# Altium schematic sheet 1_电源部分.schdoc.schdoc
size 431 x 309 mm; Symbol: Sheet-Symbol_A3; Device: Sheet-Symbol_A3; Company: 深圳嘉立创科技发展有限公司; Drawed: 嘉立创EDA; Reviewed: 嘉立创EDA; Version: V0.1; Page Size: A2; @Project Name: 毕业设计板子1; @Page Count: 3; @Update Date: 2024-03-13; @Create Date: 2024-02-22; @Schematic Name: Schematic1; Part Number: JLCPCB-001; @Page No: 1; @Page Name: 电源部分
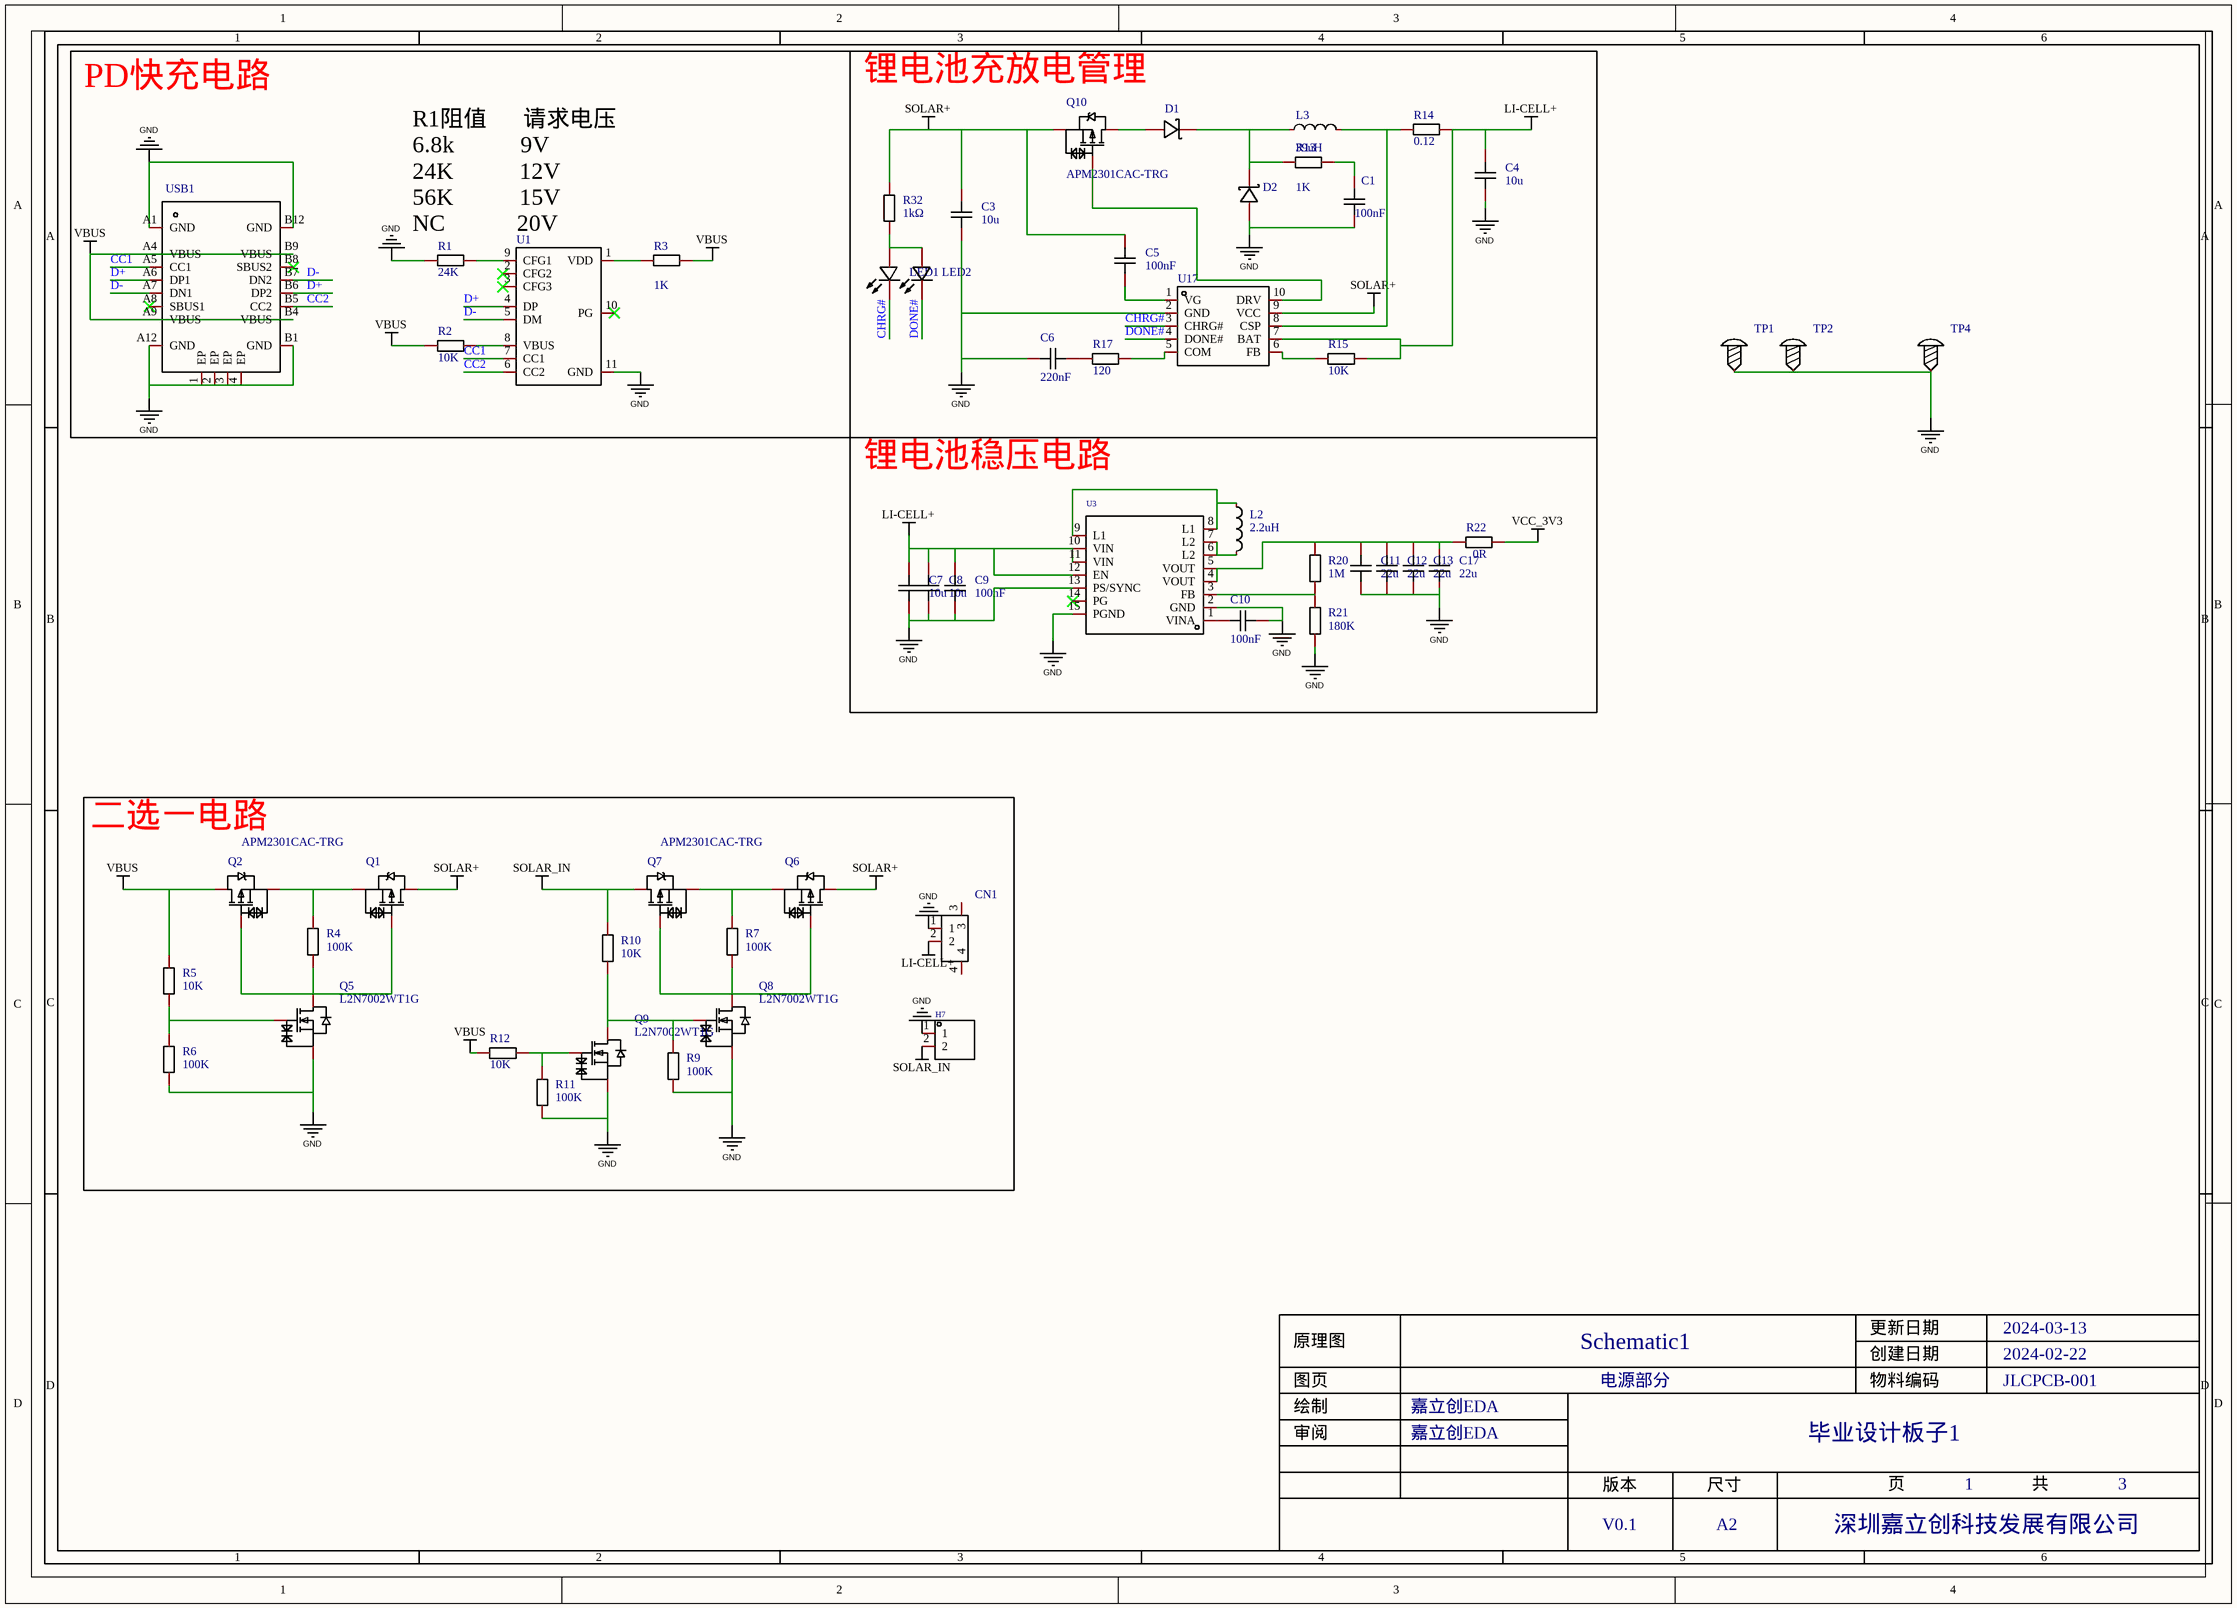
[diagram p0: 1_电源部分.schdoc.schdoc]

## Parts
C1  value 100nF  [C0402]  (hidden comment: CAP_0402)
C3  value 10u  [C0805]  (hidden comment: CAP_0805)
C4  value 10u  [C0805]  (hidden comment: CAP_0805)
C5  value 100nF  [C0402]  (hidden comment: CAP_0402)
C6  value 220nF  [C0402]  (hidden comment: CAP_0402)
C7  value 10u  [C0805]  (hidden comment: CAP_0805)
C8  value 10u  [C0805]  (hidden comment: CAP_0805)
C9  value 100nF  [C0402]  (hidden comment: CAP_0402)
C10  value 100nF  [C0402]  (hidden comment: CAP_0402)
C11  value 22u  [C0805]  (hidden comment: CAP_0805)
C12  value 22u  [C0805]  (hidden comment: CAP_0805)
C13  value 22u  [C0805]  (hidden comment: CAP_0805)
C17  value 22u  [C0805]  (hidden comment: CAP_0805)
CN1  HCZZ0021-2  [CONN-SMD_2P-P2.50-A2501-WF-02A]  (value not drawn)
D1  B340A  [SMA_L4.3-W2.6-LS5.1-RD]  (value not drawn)
D2  B340A  [SMA_L4.3-W2.6-LS5.1-RD]  (value not drawn)
H7  HDR-M_2.54_1x2P  [HDR-TH_2P-P2.54-V-M-1]  (value not drawn)
L2  value 2.2uH  [IND-SMD_L4.4-W4.2]  (hidden comment: MWSA0402S-2R2MT)
L3  value 39uH  [IND-SMD_L10.1-W10.0]  (hidden comment: YDRH104R-390M)
LED1  NCD0805R1  [LED0805-R-RD]  (value not drawn)
LED2  NCD0805R1  [LED0805-R-RD]  (value not drawn)
Q1  APM2301CAC-TRG  [SOT-23-3_L2.9-W1.6-P1.90-LS2.8-BR]  (value not drawn)
Q2  APM2301CAC-TRG  [SOT-23-3_L2.9-W1.6-P1.90-LS2.8-BR]
Q5  L2N7002WT1G  [SC-70-3_L2.1-W1.3-P1.30-LS2.1-BR]
Q6  APM2301CAC-TRG  [SOT-23-3_L2.9-W1.6-P1.90-LS2.8-BR]  (value not drawn)
Q7  APM2301CAC-TRG  [SOT-23-3_L2.9-W1.6-P1.90-LS2.8-BR]
Q8  L2N7002WT1G  [SC-70-3_L2.1-W1.3-P1.30-LS2.1-BR]
Q9  L2N7002WT1G  [SC-70-3_L2.1-W1.3-P1.30-LS2.1-BR]
Q10  APM2301CAC-TRG  [SOT-23-3_L2.9-W1.6-P1.90-LS2.8-BR]
R1  value 24K  [R0402]  (hidden comment: Res_0402)
R2  value 10K  [R0402]  (hidden comment: Res_0402)
R3  value 1K  [R0402]  (hidden comment: Res_0402)
R4  value 100K  [R0402]  (hidden comment: Res_0402)
R5  value 10K  [R0402]  (hidden comment: Res_0402)
R6  value 100K  [R0402]  (hidden comment: Res_0402)
R7  value 100K  [R0402]  (hidden comment: Res_0402)
R9  value 100K  [R0402]  (hidden comment: Res_0402)
R10  value 10K  [R0402]  (hidden comment: Res_0402)
R11  value 100K  [R0402]  (hidden comment: Res_0402)
R12  value 10K  [R0402]  (hidden comment: Res_0402)
R13  value 1K  [R0402]  (hidden comment: Res_0402)
R14  value 0.12  [R1206]  (hidden comment: Res_1206)
R15  value 10K  [R0402]  (hidden comment: Res_0402)
R17  value 120  [R0402]  (hidden comment: Res_0402)
R20  value 1M  [R0402]  (hidden comment: Res_0402)
R21  value 180K  [R0402]  (hidden comment: Res_0402)
R22  value 0R  [R0402]  (hidden comment: Res_0402)
R32  value 1kΩ  [R0805]  (hidden comment: 0805W8F4701T5E)
TP1  M3螺丝  [M3螺丝]  (value not drawn)
TP2  M3螺丝  [M3螺丝]  (value not drawn)
TP4  M3螺丝  [M3螺丝]  (value not drawn)
U1  CH224K  [ESSOP-10_L4.9-W3.9-P1.0-LS6.0-TL-EP]  (value not drawn)
U3  TPS63020DSJT  [VSON-14_L4.0-W3.0-P0.50-BL-EP_TI_DSJ]  (value not drawn)
U17  CN3781  [SSOP-10_L4.9-W3.9-P1.00-LS6.0-BL]  (value not drawn)
USB1  USB_TYPE-C-16P  [USB_TYPE-C-16P]  (value not drawn)

## Blocks framed on the sheet
PD快充电路: R1-R3 U1 USB1
锂电池充放电管理: C1 C3-C6 D1 D2 L3 LED1 LED2 Q10 R13-R15 R17 R32 U17
锂电池稳压电路: C7-C13 C17 L2 R20-R22 U3
二选一电路: CN1 H7 Q1 Q2 Q5-Q9 R4-R7 R9-R12

## Nets
GND: C1.1 C3.1 C4.1 C6.2 C7.1 C8.1 C9.1 C10.1 C11.1 C12.1 C13.1 C17.1 CN1.1 D2.2(A) H7.1 Q5.2(S) Q8.2(S) Q9.2(S) R1.1 R6.1 R9.1 R11.1 R21.1 TP1.1 TP2.1 TP4.1 U1.11(GND) U3.2(GND) U3.13(PS/SYNC) U3.15(PGND) U17.2(GND) USB1.1(EP) USB1.2(EP) USB1.3(EP) USB1.4(EP) USB1.A1(GND) USB1.A12(GND) USB1.B1(GND) USB1.B12(GND)
LI-CELL+: C4.2 C7.2 C8.2 C9.2 CN1.2 R14.2 R15.2 U3.10(VIN) U3.11(VIN) U3.12(EN) U17.7(BAT)
SOLAR+: C3.2 C5.2 Q1.3(D) Q6.3(D) Q10.2(S) R32.2 U17.9(VCC)
SOLAR_IN: H7.2 Q7.3(D) R10.2
VBUS: Q2.3(D) R2.1 R3.2 R5.2 R12.2 USB1.A4(VBUS) USB1.A9(VBUS) USB1.B4(VBUS) USB1.B9(VBUS)
VCC_3V3: R22.2
CC1: U1.7(CC1) USB1.A5(CC1)
CC2: U1.6(CC2) USB1.B5(CC2)
CHRG#: LED1.2(-) U17.3(CHRG#)
D+: U1.4(DP) USB1.A6(DP1) USB1.B6(DP2)
D-: U1.5(DM) USB1.A7(DN1) USB1.B7(DN2)
DONE#: LED2.2(-) U17.4(DONE#)
NetC1_2: C1.2 R13.2
NetC5_1: C5.1 U17.1(VG)
NetC6_1: C6.1 R17.2
NetC10_2: C10.2 U3.1(VINA)
NetC11_2: C11.2 C12.2 C13.2 C17.2 R20.2 R22.1 U3.4(VOUT) U3.5(VOUT)
NetD1_1: D1.1(K) D2.1(K) L3.1 R13.1
NetD1_2: D1.2(A) Q10.3(D)
NetL2_1: L2.1 U3.8(L1) U3.9(L1)
NetL2_2: L2.2 U3.6(L2) U3.7(L2)
NetL3_2: L3.2 R14.1 U17.8(CSP)
NetLED1_1: LED1.1(+) LED2.1(+) R32.1
NetQ1_1: Q1.1(G) Q2.1(G) Q5.3(D) R4.1
NetQ1_2: Q1.2(S) Q2.2(S) R4.2
NetQ5_1: Q5.1(G) R5.1 R6.2
NetQ6_1: Q6.1(G) Q7.1(G) Q8.3(D) R7.1
NetQ6_2: Q6.2(S) Q7.2(S) R7.2
NetQ8_1: Q8.1(G) Q9.3(D) R9.2 R10.1
NetQ9_1: Q9.1(G) R11.2 R12.1
NetQ10_1: Q10.1(G) U17.10(DRV)
NetR1_2: R1.2 U1.9(CFG1)
NetR2_2: R2.2 U1.8(VBUS)
NetR3_1: R3.1 U1.1(VDD)
NetR15_1: R15.1 U17.6(FB)
NetR17_1: R17.1 U17.5(COM)
NetR20_1: R20.1 R21.2 U3.3(FB)

Not connected (* = marked no-connect by the designer): CN1 3 4; U1 2(CFG2)* 3(CFG3)* 10(PG)*; U3 14(PG)*; USB1 A8(SBUS1)* B8(SBUS2)*

## Notes on the sheet
- R1阻值      请求电压
  6.8k           9V
  24K           12V
  56K           15V
  NC            20V
- 1
- 2
- 3
- 4
- 5
- 6
- A
- B
- C
- 原理图
- Schematic1
- 创建日期
- 更新日期
- 2024-03-13
- 2024-02-22
- D
- 审阅
- 绘制
- 图页
- 嘉立创EDA
- 电源部分
- 物料编码
- 毕业设计板子1
- JLCPCB-001
- 版本
- 尺寸
- 页
- 共
- V0.1
- A2
- 深圳嘉立创科技发展有限公司

## Library data of the parts
C1 C5 C6 C9 C10 = CAP_0402: Symbol: CapAcitance; Convert to PCB: yes; Device: CAP_0402; Add into BOM: yes; Supplier Footprint: 0402
C3 C4 C7 C8 C11-C13 C17 = CAP_0805: Symbol: CapAcitance; Convert to PCB: yes; Device: CAP_0805; Add into BOM: yes; Supplier Footprint: 0805
CN1 = HCZZ0021-2: Manufacturer: HC(虹成电子); Add into BOM: yes; Pins Structure: 1x2P; Pitch: 2.54mm; Reference Series: XH; Number of PINs Per Row: 2; Current Rating (Max): 3A; Description: 插针结构:1x2P;间距:2.54mm;安装方式:卧贴;参考系列:XH;总PIN数:2P;排数:1;每排PIN数:2;额定电流:3A;触头材质:黄铜;触头镀层:镀锡;工作温度范围:-25℃~+85℃;; Symbol: HCZZ0021-2; Device: HCZZ0021-2; Supplier: LCSC; Supplier Part: C7433707; Manufacturer Part: HCZZ0021-2; JLCPCB Part Class: 扩展库; LCSC Part Name: 1x2P 间距:2.54mm 卧贴 系列:XH 米色; Supplier Footprint: SMD,P=2.54mm,卧贴; Datasheet: https://atta.szlcsc.com/upload/public/pdf/source/20230707/5E06D7876EC1A6B82AA5D7C4A4436E93.pdf; Convert to PCB: yes; Mounting Style: 卧贴; Number of Pins: 2P; Number of Rows: 1; Contact Material: 黄铜; Contact Plating: 镀锡; Operating Temperature Range: -25℃~+85℃
D1 D2 = B340A: Manufacturer: MDD; Add into BOM: yes; Forward Voltage (Vf@If): 550mV@3A; Reverse Voltage (Vr): 40V; Average Rectified Current (Io): 3A; Description: 正向压降(Vf):550mV@3A;直流反向耐压(Vr):40V;平均整流电流(Io):3A;; Symbol: B340A; Device: B340A; Supplier: LCSC; Manufacturer Part: B340A; Supplier Part: C64982; JLCPCB Part Class: 扩展库; LCSC Part Name: 电压:40V 电流:3A; Supplier Footprint: SMA(DO-214AC); Datasheet: https://atta.szlcsc.com/upload/public/pdf/source/20230710/CC7CF81239BC87A7012E02A96905E83C.pdf; Convert to PCB: yes
H7 = HDR-M_2.54_1x2P: Manufacturer: Ckmtw(灿科盟); Manufacturer Part: B-2100S02P-A110; Symbol: 210S-1*2P L=11.6MMGold-plated black; Convert to PCB: yes; Device: HDR-M_2.54_1x2P; Supplier: LCSC; Supplier Part: C124375; JLCPCB Part Class: Extended Part; Add into BOM: yes; Supplier Footprint: 插件
L2 = MWSA0402S-2R2MT: Manufacturer: Sunlord(顺络); Add into BOM: yes; Tolerance: ±20%; Rated Current: 4.5A; Saturation Current (Isat): 5A; DC Resistance (DCR): 58mΩ; Description: 电感值:2.2uH;精度:±20%;额定电流:4.5A;饱和电流(Isat):5A;类型:-;; Symbol: MWSA0402S-2R2MT; Device: MWSA0402S-2R2MT; LCSC Part Name: 2.2uH ±20% 5A; Supplier Part: C408335; Manufacturer Part: MWSA0402S-2R2MT; Supplier Footprint: SMD; JLCPCB Part Class: 扩展库; Datasheet: https://atta.szlcsc.com/upload/public/pdf/source/20231024/D9DB0CBBB5804BFBC9233D4A02F4216A.pdf; Supplier: LCSC; Convert to PCB: yes; Type: -; Ratings: -
L3 = YDRH104R-390M: Manufacturer: YJYCOIN(益嘉源); Add into BOM: yes; Tolerance: ±20%; Rated Current: 2A; DC Resistance (DCR): 127mΩ; Description: 电感值:39uH;精度:±20%;额定电流:2A;; Symbol: YDRH104R-390M; Device: YDRH104R-390M; Supplier: LCSC; Supplier Part: C339965; Manufacturer Part: YDRH104R-390M; JLCPCB Part Class: 扩展库; LCSC Part Name: 39uH ±20%; Supplier Footprint: SMD,10.1x10.1mm; Datasheet: https://atta.szlcsc.com/upload/public/pdf/source/20200623/C339963_A696F5E6C39A97F8B8D4340808E952C2.pdf; Convert to PCB: yes
LED1 LED2 = NCD0805R1: Manufacturer: 国星光电; Symbol: FC-2012HRK-620D; Add into BOM: yes; Emitted Color: 红色; Forward Voltage (VF): 1.6V~2.6V; Power Dissipation: 65mW; Forward Current: 20mA; Dominant Wavelength: 615nm~630nm; Diode Configuration: 独立二极管; Lens Color: 无色透明透镜; Luminous Intensity: 67mcd~195mcd; Viewing Angle: 130°; Description: 灯头类型:-;发光颜色:红色;正向电压(VF):1.6V~2.6V;功率:65mW;正向电流:20mA;主波长:615nm~630nm;二极管配置:独立二极管;透镜颜色:无色透明透镜;色温:-;发光强度:67mcd~195mcd;发光角度:130°;载带方式:-;工作温度:-30℃~+85℃;; Device: NCD0805R1; Supplier: LCSC; Manufacturer Part: NCD0805R1; Supplier Part: C84256; JLCPCB Part Class: 基础库; LCSC Part Name: NCD0805R1; Supplier Footprint: 0805; Datasheet: https://atta.szlcsc.com/upload/public/pdf/source/20200820/C84256_F0A75A43B3EAD75808600A0514C76B99.pdf; Convert to PCB: yes; Lamp Holder Type: -; Peak Wavelength: -; Color Temperature: -; Mounting Sytle: -; Operating Temperature: -30℃~+85℃
Q1 Q2 Q6 Q7 Q10 = APM2301CAC-TRG: Manufacturer: Sinopower(大中); Add into BOM: yes; Type: P沟道; Drain Source Voltage (Vdss): 20V; Continuous Drain Current (Id): 3A; Power Dissipation (Pd): 830mW; Drain Source On Resistance (RDS(on)@Vgs,Id): 70mΩ@4.5V,3A; Gate Threshold Voltage (Vgs(th)@Id): 1V@250uA; Description: 类型:P沟道;漏源电压(Vdss):20V;连续漏极电流(Id):3A;功率(Pd):830mW;导通电阻(RDS(on)@Vgs,Id):70mΩ@4.5V,3A;阈值电压(Vgs(th)@Id):1V@250uA;; Symbol: APM2301CAC-TRG; Device: APM2301CAC-TRG; LCSC Part Name: P沟道 耐压:20V 电流:3A; Supplier Part: C207575; Manufacturer Part: APM2301CAC-TRG; Supplier Footprint: SOT-23; JLCPCB Part Class: 扩展库; Datasheet: https://atta.szlcsc.com/upload/public/pdf/source/20180412/C207575_1A299DA5768E38A1E092D1ED43A93CE9.pdf; Supplier: LCSC; Convert to PCB: yes
Q5 Q8 Q9 = L2N7002WT1G: Manufacturer: LRC(乐山无线电); Add into BOM: yes; Type: N沟道; Drain Source Voltage (Vdss): 60V; Continuous Drain Current (Id): 115mA; Power Dissipation (Pd): 225mW; Drain Source On Resistance (RDS(on)@Vgs,Id): 7.5Ω@10V,500mA; Gate Threshold Voltage (Vgs(th)@Id): 2.5V@250uA; Description: 类型:N沟道;漏源电压(Vdss):60V;连续漏极电流(Id):115mA;功率(Pd):225mW;导通电阻(RDS(on)@Vgs,Id):7.5Ω@10V,500mA;阈值电压(Vgs(th)@Id):2.5V@250uA;; Symbol: L2N7002WT1G; Device: L2N7002WT1G; Supplier: LCSC; Manufacturer Part: L2N7002WT1G; Supplier Part: C12778; JLCPCB Part Class: 扩展库; LCSC Part Name: N沟道 耐压:60V 电流:115mA; Supplier Footprint: SC-70-3; Datasheet: https://atta.szlcsc.com/upload/public/pdf/source/20130604/1457706607592.pdf; Convert to PCB: yes
R1-R7 R9-R13 R15 R17 R20-R22 = Res_0402: Symbol: 电阻; Convert to PCB: yes; Device: Res_0402; Add into BOM: yes; Supplier Footprint: 0402
R14 = Res_1206: Symbol: 电阻; Add into BOM: yes; Device: Res_1206; Supplier Footprint: 1206; Convert to PCB: yes
R32 = 0805W8F4701T5E: Manufacturer: UNI-ROYAL(厚声); Add into BOM: yes; Tolerance: ±1%; Power(Watts): 125mW; Overload Voltage (Max): 150V; Temperature Coefficient: ±100ppm/℃; Description: 电阻类型:厚膜电阻;阻值:4.7kΩ;精度:±1%;功率:125mW;最大工作电压:150V;温度系数:±100ppm/℃;; Symbol: 0805W8F4701T5E; Device: 0805W8F4701T5E; Supplier: LCSC; Manufacturer Part: 0805W8F4701T5E; Supplier Part: C17673; JLCPCB Part Class: 基础库; LCSC Part Name: 4.7kΩ ±1% 125mW 厚膜电阻; Supplier Footprint: 0805; Datasheet: https://atta.szlcsc.com/upload/public/pdf/source/20200306/C422600_1E6D84923E4A46A82E41ADD87F860B5C.pdf; Convert to PCB: yes; Type: 厚膜电阻; Operating Temperature Range: -55℃~+155℃
TP1 TP2 TP4 = M3螺丝: Symbol: 螺丝孔; Convert to PCB: yes; Device: M3螺丝; Add into BOM: yes; Supplier Footprint: 插件
U1 = CH224K: Manufacturer: WCH(南京沁恒); Add into BOM: yes; Applications Function: USB充电芯片; Description: 应用功能:USB充电芯片;; Symbol: CH224K; Device: CH224K; Supplier: LCSC; Supplier Part: C970725; Manufacturer Part: CH224K; JLCPCB Part Class: 扩展库; LCSC Part Name: USB PD等多快充协议受电芯片CH224; Supplier Footprint: ESSOP-10; Datasheet: https://atta.szlcsc.com/upload/public/pdf/source/20220425/5F3B4646B9AC793D88468BCB08421765.pdf; Convert to PCB: yes
U3 = TPS63020DSJT: Manufacturer: TI(德州仪器); Add into BOM: yes; Symbol: TPS63020DSJT; Device: TPS63020DSJT; Supplier: LCSC; Supplier Part: C544952; Manufacturer Part: TPS63020DSJT; JLCPCB Part Class: 扩展库; LCSC Part Name: TPS63020DSJT; Supplier Footprint: VSON-14-EP(3x4); Datasheet: https://www.ti.com/cn/lit/gpn/tps63021; Convert to PCB: yes
U17 = CN3781: Manufacturer: CONSONANCE(上海如韵); Add into BOM: yes; Symbol: CN3781; Device: CN3781; LCSC Part Name: CN3781; Supplier Part: C840498; Manufacturer Part: CN3781; Supplier Footprint: SSOP-10-150mil; JLCPCB Part Class: 扩展库; Datasheet: https://atta.szlcsc.com/upload/public/pdf/source/20200918/C840498_79BA2C7E53B746AAB5969ECEE01951BA.pdf; Supplier: LCSC; Convert to PCB: yes
USB1 = USB_TYPE-C-16P: Add into BOM: yes; Symbol: USB_TYPE-C-16P; Device: USB_TYPE-C-16P; Supplier Footprint: SMD; Convert to PCB: yes